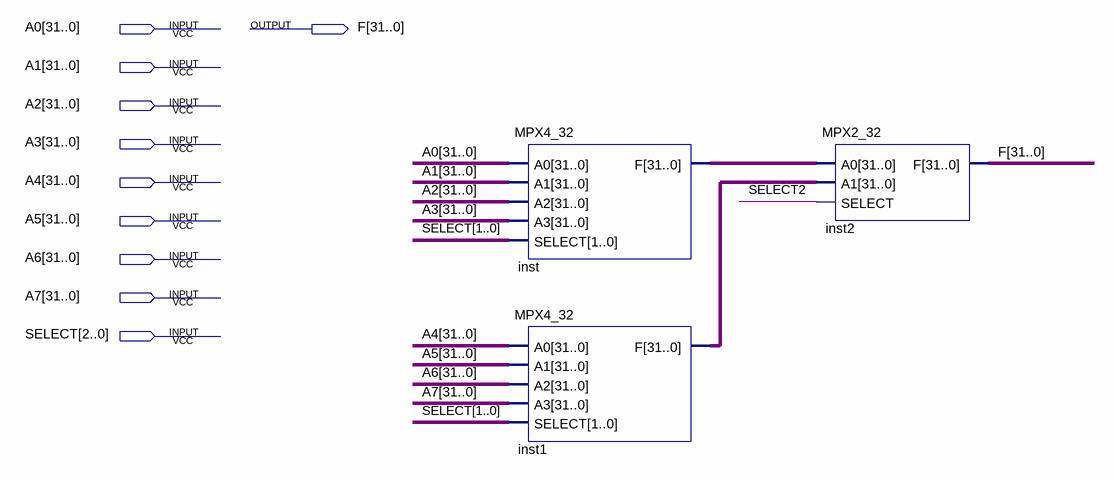
[diagram p0: schematic sheet]
// Quartus schematic MPX8_32.bdf as structural Verilog: 3 symbols, 10 pins
module MPX8_32 (
  input  [31:0] A0,
  input  [31:0] A1,
  input  [31:0] A2,
  input  [31:0] A3,
  input  [31:0] A4,
  input  [31:0] A5,
  input  [31:0] A6,
  input  [31:0] A7,
  input  [2:0] SELECT,
  output [31:0] F
);

  wire [31:0] inst1_f, inst_f;

  MPX4_32 inst (.A0(A0), .A1(A1), .A2(A2), .A3(A3), .SELECT(SELECT[1:0]), .F(inst_f));
  MPX4_32 inst1 (.A0(A4), .A1(A5), .A2(A6), .A3(A7), .SELECT(SELECT[1:0]), .F(inst1_f));
  MPX2_32 inst2 (.A0(inst_f), .A1(inst1_f), .SELECT(SELECT[2]), .F(F));
endmodule
